# Altium schematic sheet Non-relay fused CKT.SchDoc
size A
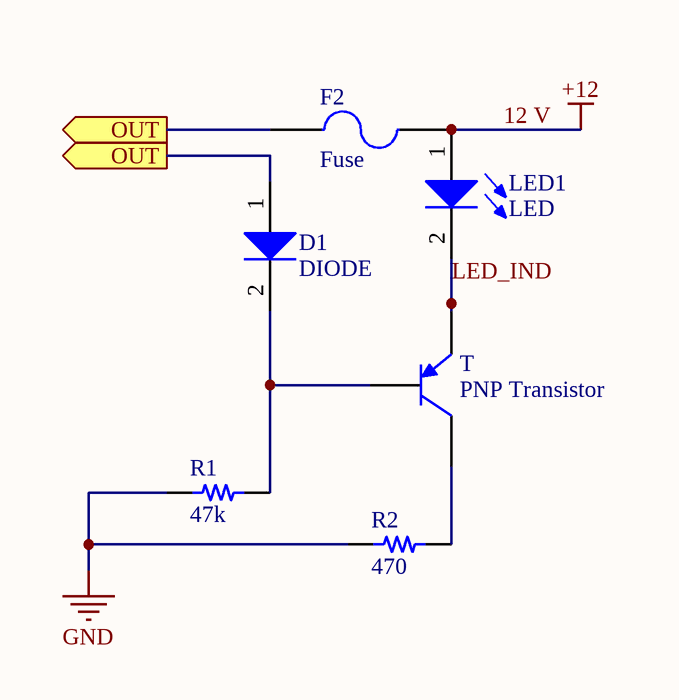
[diagram p0: Non-relay fused CKT.SchDoc]

## Parts
D1  DIODE  [SOD123F]
F2  Fuse  [3568-MiniFuseHolder]
LED1  LED  [0805_LED]
R1  value 47k  [RES 0805/2012]  (hidden comment: Resistor 47k 0805 1/10W 1%)
R2  value 470  [RES 0805/2012]  (hidden comment: Resistor 470 0805 1/10W 1%)
T  PNP Transistor  [SOT23-3]

## Ports
OUT (out)

## Nets
12 V: F2.2 LED1.1(A)  [also labelled +12]
GND: R1.2 R2.2
LED_IND: LED1.2(K) T.2(E)
OUT: D1.1(A) F2.1 ; port OUT
NetD1_2: D1.2(K) R1.1 T.1(B)
NetR2_1: R2.1 T.3(C)

## Library data of the parts
D1 = 2: Diode Super Barrier 40V 1A Surface Mount SOD-123F; Manufacturer_id: 1; MfrPartNo: 1N5819HW1-7-F; idDiode: 2; Name: 1N5819; Drawer_id: 1; Value: 1A; Type: Super Barrier; Num_Circuits: 1; Ic: 1A; Power: 40V; Package: SOD-123; Link: https://www.digikey.com/product-detail/en/diodes-incorporated/1N5819HW1-7-F/1N5819HW1-7-FDITR-ND/5768523; ComponentLink1Description: Datasheet; ComponentLink1URL: https://www.diodes.com/assets/Datasheets/1N5819HW1.pdf; Supplier1: Digi-Key; Supplier1PartNo: 1N5819HW1-7-FDITR-ND
F2 = 3: Manufacturer_id: 1; idFuse: 3; Name: 3568 Mini Fuse Holder; Drawer_id: 1
LED1 = 1: idLED: 1; Name: LED_0805_RED; Value: Red; Vf: 0.7V; Manufacturer_id: 1; Drawer_id: 1; Package: 0805
R1 = 545: Manufacturer_id: 1; idResistor: 545; Name: Res_47k_0805_1/10W_1%; Created_By: Nick Mah; Supplier 1: Digi-Key; Drawer_id: 1; Tolerance: 1%; Power: 1/10W; Package: 0805; ComponentLink1Description: Datasheet; Created_Date: 2018-10-20
R2 = 497: Manufacturer_id: 1; idResistor: 497; Name: Res_470_0805_1/10W_1%; Created_By: Nick Mah; Supplier 1: Digi-Key; Drawer_id: 1; Tolerance: 1%; Power: 1/10W; Package: 0805; ComponentLink1Description: Datasheet; Created_Date: 2018-10-20
T = 3: Manufacturer_id: 1; idBJT: 3; Name: MMBT4403WT1G; Ic: 600mA; Vce(Max): -40V; Created_By: Angel; Drawer_id: 1; Type: PNP; Num_Circuits: 1; Package: SOT23-3; MfrPartNo: MMBT4403WT1G; Link: https://www.digikey.com/product-detail/en/on-semiconductor/MMBT4403WT1G/MMBT4403WT1GOSCT-ND/3487572